# EAGLE design Robo-Badge_v10 (EAGLE 7.7.0)
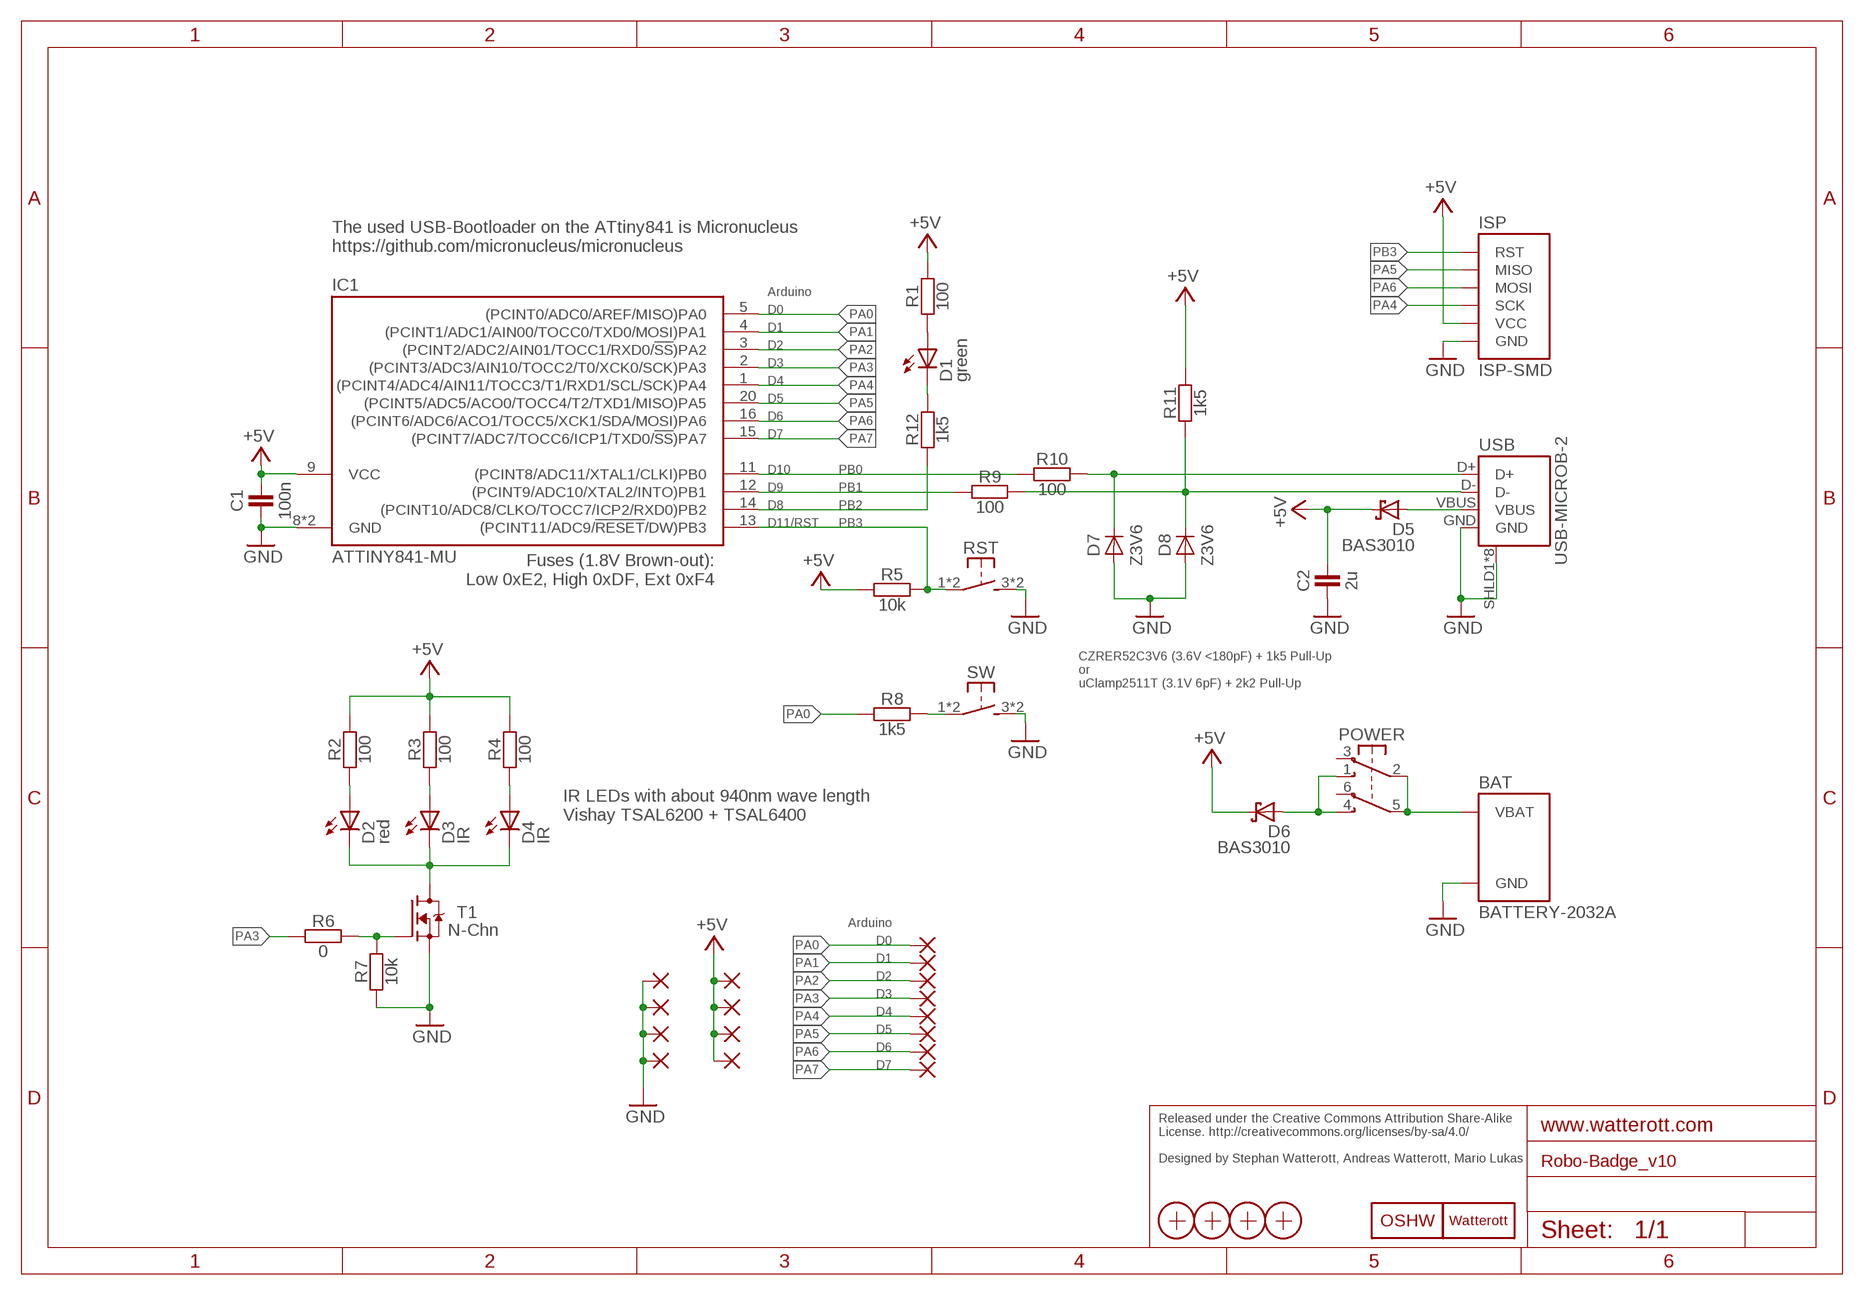
[diagram p0: schematic, sheet 1]

## Parts
BAT  BATTERY-2032A  [BAT-4UC-05581]
C1  100n  CAPACITOR-0402  [C0402]
C2  2u  CAPACITOR-0402  [C0402]
D1  green  LED-5MM  [LED_5MM]
D2  red  LED-5MM  [LED_5MM]
D3  IR  LED-5MM  [LED_5MM]
D4  IR  LED-5MM  [LED_5MM]
D5  BAS3010  D_SCHOTTKY-SOD323  [SOD323]
D6  BAS3010  D_SCHOTTKY-SOD323  [SOD323]
D7  Z3V6  DIODE-SOD723  [SOD723]
D8  Z3V6  DIODE-SOD723  [SOD723]
GND_1  PAD-WEARABLE  [PAD-WEARABLE]
GND_2  PAD-WEARABLE  [PAD-WEARABLE]
GND_3  PAD-WEARABLE  [PAD-WEARABLE]
GND_4  PAD-WEARABLE  [PAD-WEARABLE]
IC1  ATTINY841-MU  [QFN20-PAD]
ISP  ISP-SMD  [ISP-2X3_SMD]
LOGO1  LOGO-S_PLACE_M  [SPARK_TPLACE_M]
LOGO2  OSHW_LOGOX0150  [OSHW_6X150]
PA0  PAD-WEARABLE  [PAD-WEARABLE]
PA1  PAD-WEARABLE  [PAD-WEARABLE]
PA2  PAD-WEARABLE  [PAD-WEARABLE]
PA3  PAD-WEARABLE  [PAD-WEARABLE]
PA4  PAD-WEARABLE  [PAD-WEARABLE]
PA5  PAD-WEARABLE  [PAD-WEARABLE]
PA6  PAD-WEARABLE  [PAD-WEARABLE]
PA7  PAD-WEARABLE  [PAD-WEARABLE]
POWER  SW-2UM-CUS22B  [CUS22B]
R1  100  RESISTOR10LP  [R0207/10-LARGE_PADS]
R2  100  RESISTOR10LP  [R0207/10-LARGE_PADS]
R3  100  RESISTOR10LP  [R0207/10-LARGE_PADS]
R4  100  RESISTOR10LP  [R0207/10-LARGE_PADS]
R5  10k  RESISTOR-0402  [C0402]
R6  0  RESISTOR-0402  [C0402]
R7  10k  RESISTOR-0402  [C0402]
R8  1k5  RESISTOR-0402  [C0402]
R9  100  RESISTOR-0402  [C0402]
R10  100  RESISTOR-0402  [C0402]
R11  1k5  RESISTOR-0402  [C0402]
R12  1k5  RESISTOR-0402  [C0402]
RST  SW-TACTILE-6X6  [SW6X6]
SW  SW-TACTILE-6X6  [SW6X6]
T1  N-Chn  MOSFET-N-SOT23  [SOT23]
USB  USB-MICROB-2  [USB-MICROB-10118194]
VCC_1  PAD-WEARABLE  [PAD-WEARABLE]
VCC_2  PAD-WEARABLE  [PAD-WEARABLE]
VCC_3  PAD-WEARABLE  [PAD-WEARABLE]
VCC_4  PAD-WEARABLE  [PAD-WEARABLE]
X1  PASSER-07  [PASSER_07MM]
X2  PASSER-07  [PASSER_07MM]
X3  PASSER-07  [PASSER_07MM]
X4  PASSER-07  [PASSER_07MM]

## Nets
+5V: C1.2 C2.2 D5.C D6.C IC1.9(VCC) ISP.VCC R1.2 R2.1 R3.1 R4.1 R5.2 R11.1 VCC_1.1(P) VCC_1.2(P) VCC_1.3(P) VCC_2.1(P) VCC_2.2(P) VCC_2.3(P) VCC_3.1(P) VCC_3.2(P) VCC_3.3(P) VCC_4.1(P) VCC_4.2(P) VCC_4.3(P)
D_N: D8.C R9.2 R11.2 USB.D-
D_P: D7.C R10.2 USB.D+
DC: D2.C D3.C D4.C T1.3(D)
GND: BAT.GND C1.1 C2.1 D7.A D8.A GND_1.1(P) GND_1.2(P) GND_1.3(P) GND_2.1(P) GND_2.2(P) GND_2.3(P) GND_3.1(P) GND_3.2(P) GND_3.3(P) GND_4.1(P) GND_4.2(P) GND_4.3(P) IC1.8(GND) IC1.TP(GND) ISP.GND R7.2 RST.3(S1) RST.4(S1) SW.3(S1) SW.4(S1) T1.2(S) USB.GND USB.SHLD1(SHIELD) USB.SHLD2(SHIELD) USB.SHLD3(SHIELD) USB.SHLD4(SHIELD) USB.SHLD5(SHIELD) USB.SHLD6(SHIELD) USB.SHLD7(SHIELD) USB.SHLD8(SHIELD)
LED: R6.1 R7.1 T1.1(G)
LED+: D1.A R1.1
LED-: D1.C R12.1
PA0: IC1.5((PCINT0/ADC0/AREF/MISO)PA0) PA0.1(P) PA0.2(P) PA0.3(P) R8.1
PA1: IC1.4((PCINT1/ADC1/AIN00/TOCC0/TXD0/MOSI)PA1) PA1.1(P) PA1.2(P) PA1.3(P)
PA2: IC1.3((PCINT2/ADC2/AIN01/TOCC1/RXD0/!SS!)PA2) PA2.1(P) PA2.2(P) PA2.3(P)
PA3: IC1.2((PCINT3/ADC3/AIN10/TOCC2/T0/XCK0/SCK)PA3) PA3.1(P) PA3.2(P) PA3.3(P) R6.2
PA4: IC1.1((PCINT4/ADC4/AIN11/TOCC3/T1/RXD1/SCL/SCK)PA4) ISP.SCK PA4.1(P) PA4.2(P) PA4.3(P)
PA5: IC1.20((PCINT5/ADC5/ACO0/TOCC4/T2/TXD1/MISO)PA5) ISP.MISO PA5.1(P) PA5.2(P) PA5.3(P)
PA6: IC1.16((PCINT6/ADC6/ACO1/TOCC5/XCK1/SDA/MOSI)PA6) ISP.MOSI PA6.1(P) PA6.2(P) PA6.3(P)
PA7: IC1.15((PCINT7/ADC7/TOCC6/ICP1/TXD0/!SS!)PA7) PA7.1(P) PA7.2(P) PA7.3(P)
PB0: IC1.11((PCINT8/ADC11/XTAL1/CLKI)PB0) R10.1
PB1: IC1.12((PCINT9/ADC10/XTAL2/INTO)PB1) R9.1
PB2: IC1.14((PCINT10/ADC8/CLKO/TOCC7/ICP2/RXD0)PB2) R12.2
PB3: IC1.13((PCINT11/ADC9/!RESET!/DW)PB3) ISP.RST R5.1 RST.1 RST.2(P1)
RD2: D2.A R2.2
RD3: D3.A R3.2
RD4: D4.A R4.2
SW: R8.2 SW.1 SW.2(P1)
VBAT: BAT.VBAT POWER.2(P1) POWER.5(P2)
VBUS: D5.A USB.VBUS
VCC: D6.A POWER.1(S1) POWER.4(S2)
Unconnected: POWER.3(O1) POWER.6(O2)

## Notes on the sheet
- The used USB-Bootloader on the ATtiny841 is Micronucleus 
  https://github.com/micronucleus/micronucleus
- Arduino
- D0
- D1
- D2
- D3
- D4
- D5
- D6
- D7
- D10
- D9
- D8
- D11/RST
- Fuses (1.8V Brown-out):
  Low 0xE2, High 0xDF, Ext 0xF4
- CZRER52C3V6 (3.6V <180pF) + 1k5 Pull-Up 
  or
  uClamp2511T (3.1V 6pF) + 2k2 Pull-Up
- IR LEDs with about 940nm wave length
  Vishay TSAL6200 + TSAL6400
- Arduino
- D0
- D1
- D2
- D3
- D4
- D5
- D6
- D7
- Released under the Creative Commons Attribution Share-Alike 
  License. http://creativecommons.org/licenses/by-sa/4.0/
  
  Designed by Stephan Watterott, Andreas Watterott, Mario Lukas

## Library data of the parts
BAT = we-power:BATTERY: Battery Holder
C1 C2 = we-rcl:CAPACITOR: Capacitors ...2.2uF @ 6.3V -> 0402 ...4.7uF @ 6.3V -> 0603 ...10uF @ 16V -> 0805 ...22uF @ 25V -> 1206
D1-D4 = we-opto:LED: LEDs red, green, blue -> 0603
D5 D6 = we-rcl:D_SCHOTTKY: Schottky Diodes 1A, 30V - SOD323 (BAS3010) 2A, 30V - SMA/DO214AC
D7 D8 = we-rcl:DIODE: Diodes
GND_1-GND_4 PA0 PA1-PA7 VCC_1-VCC_4 = we-rcl:PAD: Pads and Test-Points
IC1 = we-chip:ATTINY841: Atmel ATtiny441/841 AVR Microcontroller
ISP = we-board:ISP: AVR ISP connector
LOGO1 = we-symbol:LOGO: Watterott electronic Logo
LOGO2 = we-symbol:OSHW_LOGO: Open-Source-Hardware Logo
POWER = we-switch:SW-2UM: Switch; DIGIKEY: 563-1105-6-ND
R1-R12 = we-rcl:RESISTOR: Resistors all kinds in 0402 and 0603
RST SW = we-switch:SW-TACTILE: Tactile Switches
T1 = we-transistor:MOSFET-N: N-Channel MOSFET TSM3404, IRLML2502 (Vgs>=+/-20V, Vds>=20V, Id>=3A + Rds<=0.05Ohm @ Vgs=4.5V) BSS138 (Vgs>=+/-20V, Vds>=40V, Id>=0.2A + Rds<=3Ohm @ Vgs=4.5V)
USB = we-con:USB: USB Connectors; DIGIKEY: 609-4618-6-ND
X1-X4 = we-symbol:PASSER: Fiducial Markers

## Board
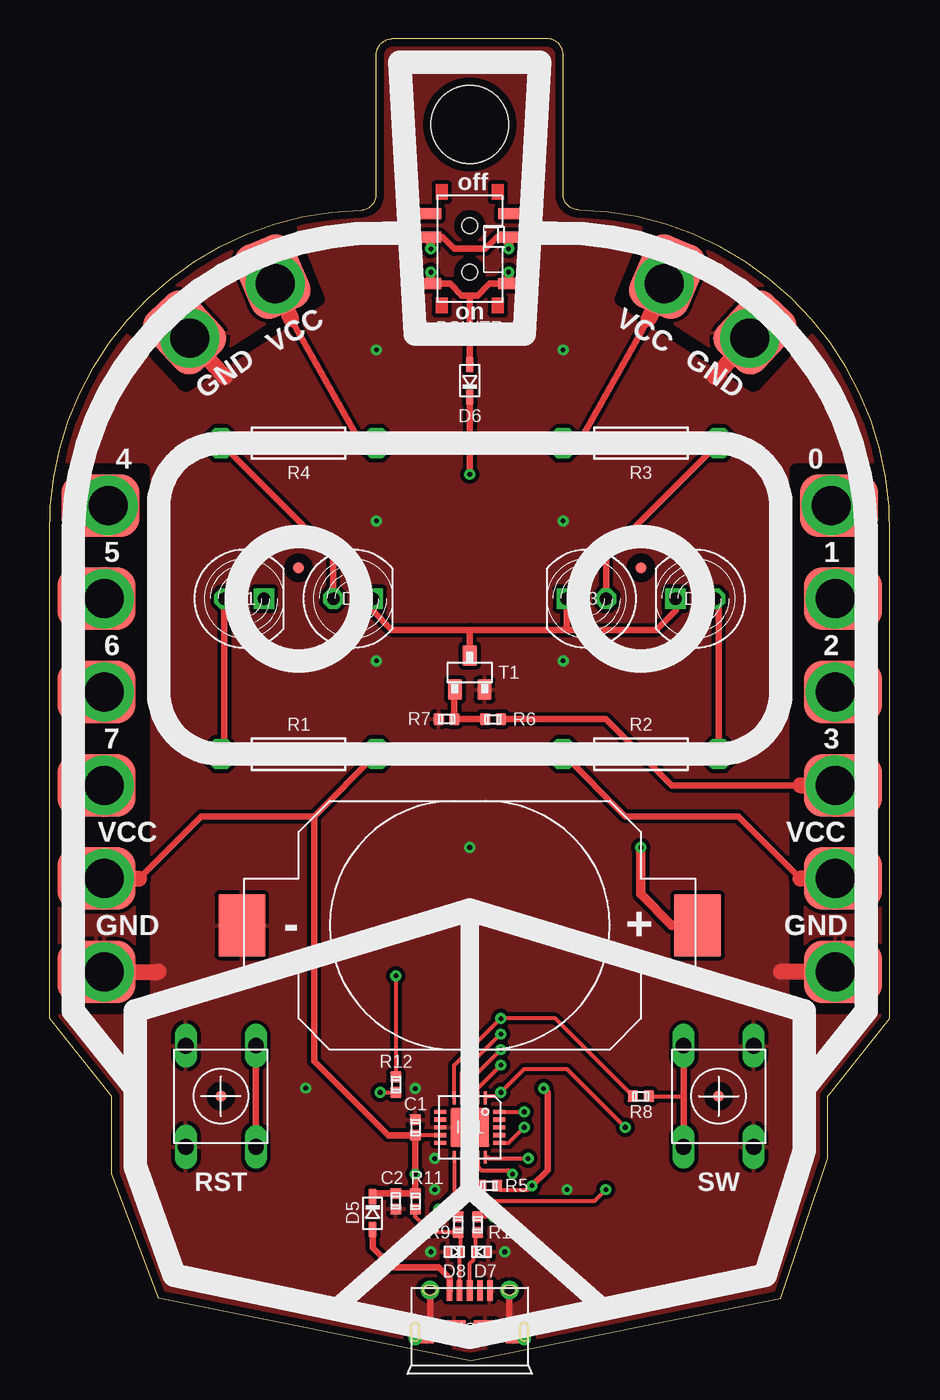
[diagram p1: board, top side]
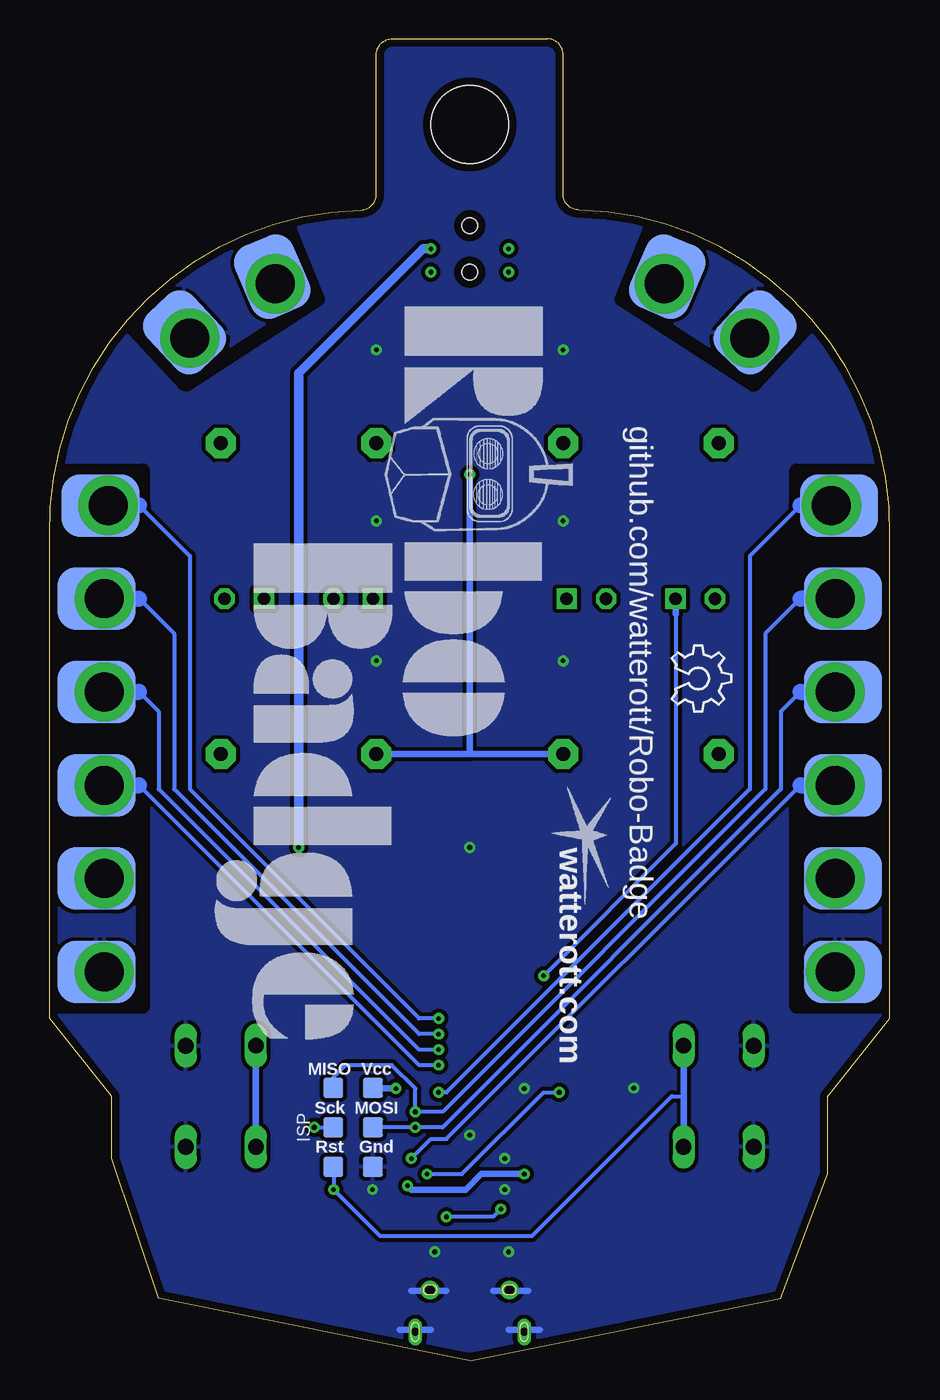
[diagram p2: board, bottom side, seen from below]

Size 54 x 85 mm. Coordinates in mm from the lower left corner, seen from the top.
Outline: 27,0 7,4 4,12 4,17 0,22 0,53 arc-90 20,74 arc90 21,75 21,84 arc-90 22,85 32,85 arc-90 33,84 33,75 arc90 34,74 arc-90 54,53 54,22 50,17 50,13 47,4 27,0
Copper layers (1*16): Top 0.035mm / dielectric 1.5mm / Bottom 0.035mm
Design rules "we-dru-2-layer *": minimum track width 0.15mm, minimum drill 0.3mm, track to track 0.15mm, track to pad 0.15mm, pad to pad 0.15mm, via to via 0.15mm, smd to smd 0.1mm, copper to edge 0.5mm, drill to drill 0.2mm, minimum pad ring 0.18mm, minimum via ring 0.2mm, stop-mask expansion 0.1mm, vias tented up to drill 0.5mm, thermal gap 0.25mm
Holes 5 mm at 27,79.5
tRestrict: 12 lines
bRestrict: 12 lines

### Footprints (pad centres in the part's own frame; a part is rotated, then mirrored left to right if it is on the bottom)
BAT-4UC-05581 = smd 4 x 3: GND 0,-14.65; VBAT 0,14.65
C0402 = smd 0.75 x 0.7: 1 0,0.5; 2 0,-0.5
LED_5MM = drill 0.8 pad 1.3 octagon: A 0,-1.27 | drill 0.8 pad 1.3 square: C 0,1.27
SOD323 = smd 0.5 x 1: A 0,-1.05; C 0,1.05
SOD723 = smd 0.8 x 0.5: A 0,-0.425; C 0,0.425
PAD-WEARABLE = drill 2.5 pad 3.81: 1 0,0 | smd 5 x 4 bottom: 2 0.5,0 | smd 5 x 4: 3 0.5,0
QFN20-PAD = smd 0.8 x 0.26: 1 -1.9,1; 2 -1.9,0.5; 3 -1.9,0; 4 -1.9,-0.5; 5 -1.9,-1; 11 1.9,-1; 12 1.9,-0.5; 13 1.9,0; 14 1.9,0.5; 15 1.9,1 | smd 0.26 x 0.8: 6 -1,-1.9; 7 -0.5,-1.9; 8 0,-1.9; 9 0.5,-1.9; 10 1,-1.9; 16 1,1.9; 17 0.5,1.9; 18 0,1.9; 19 -0.5,1.9; 20 -1,1.9 | smd 2.5 x 2.5: TP 0,0
ISP-2X3_SMD = smd 1.27 x 1.27: GND 1.27,-2.54; MISO -1.27,2.54; MOSI 1.27,0; RST -1.27,-2.54; SCK -1.27,0; VCC 1.27,2.54
CUS22B = smd 0.7 x 1.5: 1 -2.25,2.55; 2 0.75,2.55; 3 2.25,2.55; 4 -2.25,-2.55; 5 0.75,-2.55; 6 2.25,-2.55 | hole 1: -1.5,0; 1.5,0
R0207/10-LARGE_PADS = drill 0.9 pad 1.93 octagon: 1 -5,0; 2 5,0
SW6X6 = drill 1 long: 1 -3.25,2.25; 2 3.25,2.25 | drill 1.016 long: 3 -3.25,-2.25; 4 3.25,-2.25
SOT23 = smd 1.3 x 0.9: 1 -1.1,0.95; 2 -1.1,-0.95; 3 1.1,0
USB-MICROB-10118194 = smd 1.3 x 0.4: D+ -2.5,0; D- -2.5,-0.65; GND -2.5,1.3; ID -2.5,0.65; VBUS -2.5,-1.3 | drill 0.6 pad 1.2: SHLD1 -2.55,2.55; SHLD2 -2.55,-2.55 | drill 0.5 pad 0.8 long: SHLD3 0.15,3.5; SHLD4 0.15,-3.5 | smd 1.5 x 1.1: SHLD5 0.15,2.85; SHLD6 0.15,-2.85 | smd 1.5 x 1.5: SHLD7 0.15,1; SHLD8 0.15,-1
PASSER_07MM = smd 0.7 x 0.7: X 0,0

### Placement (x,y rotation side)
BAT  27,28 270 top
C1  23.5,15 0 top
C2  22.25,10.25 180 top
D1  12.5,49 270 top
D2  41.5,49 90 top
D3  34.5,49 90 top
D4  19.5,49 270 top
D5  20.75,9.5 0 top
D6  27,63 180 top
D7  27.75,7 90 top
D8  26,7 270 top
GND_1  45,65.75 47 top
GND_2  9,65.75 133 top
GND_3  50.5,25 0 top
GND_4  3.5,25 180 top
IC1  27,15 270 top
ISP  34.5,15 0 bottom
LOGO1  19.5,33.75 270 bottom
LOGO2  14,46 270 bottom
PA0  50.25,55 0 top
PA1  50.5,49 0 top
PA2  50.5,43 0 top
PA3  50.5,37 0 top
PA4  3.75,55 180 top
PA5  3.5,49 180 top
PA6  3.5,43 180 top
PA7  3.5,37 180 top
POWER  27,71.5 90 top
R1  16,39 0 top
R2  38,39 0 top
R3  38,59 0 top
R4  16,59 180 top
R5  28.25,11.25 90 top
R6  28.5,41.25 90 top
R7  25.5,41.25 270 top
R8  38,17 90 top
R9  26.25,8.75 0 top
R10  27.5,8.75 0 top
R11  23.5,10.25 0 top
R12  22.25,17.75 0 top
RST  11,17 270 top
SW  43,17 90 top
T1  27,44.25 90 top
USB  27,2 270 top
VCC_1  39.5,69.25 67 top
VCC_2  14.5,69.25 113 top
VCC_3  50.5,31 0 top
VCC_4  3.5,31 180 top
X1  11,17 0 top
X2  16,51 0 top
X3  38,51 0 top
X4  43,17 0 top

### Tracks (layer width: path | path; a pad name or v marks a point on that pad's centre or on a via)
+5V  (via drill 0.3)
  Top 0.254: IC1.9 C1.2 | 20.75,10.75 D5.C | R5.2 29,11 30.75,11 v31,11.25
  Top 0.406: D6.C 27,59 | 15.5,67 20,59 R4.1 27,59 | 38.5,67 34,59 R3.1 27,59 | 27,59 v27,57 | VCC_3.3 VCC_3.1 | 5.75,31 9.75,35 17,35 | 17,35 R1.2 | 48.25,31 44.25,35 37,35 R2.1 | 20.75,10.75 C2.2 R11.1 v23.5,12 C1.2 21.75,14.5 17,19.25 17,35 | v31.75,17.5 32,17.25 32,12.25 v31,11.25 | VCC_4.3 VCC_4.1 | VCC_1.2 VCC_1.1 | VCC_2.2 VCC_2.1
  Top 1.016: VCC_2.1 15.5,67 | VCC_1.1 38.5,67 | VCC_4.1 5.75,31 | VCC_3.1 48.25,31
  Bottom 0.254: 33.19,17.5 ISP.VCC
  Bottom 0.406: R1.2 27,39 | R2.1 27,39 | 27,39 v27,57 | v31.75,17.5 33.19,17.5 | v31,11.25 30.75,11 27.25,11 26.25,12 v23.5,12 | 50,31 VCC_3.1 VCC_3.3 | VCC_4.3 VCC_4.1 | VCC_1.2 VCC_1.1 | VCC_2.2 VCC_2.1
D_N
  Top 0.254: USB.D- 26.35,6.95 D8.C 26.4,7.03 26.4,8.1 R9.2 24.5,8.25 23.5,9.25 R11.2
D_P
  Top 0.254: USB.D+ 27,6.25 27.25,6.5 27.25,6.92 D7.C 27.35,7.03 27.35,8.1 R10.2
DC
  Top 0.406: D4.C 20.77,48.23 22,47 27,47 | 27,47 33.25,47 | 33.25,47 39,47 40.23,48.23 D2.C | D3.C 33.23,47.02 33.25,47 | T1.3 27,47
  Bottom 0.406: 40.21,48.51 40.23,48.54 D2.C
GND  (via drill 0.3)
  Top 0.406: USB.SHLD2 24.45,1.85 USB.SHLD4 USB.SHLD5 | USB.SHLD1 29.55,1.85 USB.SHLD5 | USB.SHLD5 USB.SHLD3
  Top 1.016: GND_4.1 7,25 | GND_3.1 47,25 | GND_2.1 11.25,63.25 | GND_1.1 42.75,63.25
  Bottom 0.406: 22.5,2 24.5,2 | 29.5,2 31.5,2 | 23.25,4.5 25.5,4.5 | 28.5,4.5 30.75,4.5
  other vias: 16.46,17.52 21,65 33,65 33,54 21,45 33,45 27,14.5 24.5,7 29.25,7 24.75,13 33.25,11 27,33 24.75,11 23.5,17.5 21,54
  pour Top (isolate 0.254): 0,85 54,85 54,0 0,0
  pour Bottom (isolate 0.254): 0,85 54,85 54,0 0,0
LED
  Top 0.406: R6.1 R7.1 26,43.15 T1.1
LED+
  Top 0.406: D1.A 11.23,39.23 R1.1
LED-  (via drill 0.3)
  Top 0.254: v22.25,24.75 R12.1
  Bottom 0.254: 13.75,48 13.75,33.25 v22.25,24.75
  Bottom 0.406: 13.75,48 13.75,48.98
  Bottom 0.61: 13.75,48.98 D1.C
PA0  (via drill 0.3)
  Top 0.254: IC1.5 26,19 v29,22 32.5,22 R8.1
  Top 0.406: PA0.2 PA0.1
  Bottom 0.254: 48.25,55 45,51.75 45,36.75 30.25,22 v29,22
  Bottom 0.406: PA0.2 PA0.1
  Bottom 1.016: PA0.1 48.25,55
PA1  (via drill 0.3)
  Top 0.254: IC1.4 26.5,18.5 v29,21
  Top 0.406: PA1.2 PA1.1
  Bottom 0.254: 48.25,49 46,46.75 46,36.75 30.25,21 v29,21
  Bottom 0.406: PA1.2 PA1.1
  Bottom 1.016: PA1.1 48.25,49
PA2  (via drill 0.3)
  Top 0.254: IC1.3 27,18 v29,20
  Top 0.406: PA2.2 PA2.1
  Bottom 0.254: 48.25,43 47,41.75 47,36.75 30.25,20 v29,20
  Bottom 0.406: PA2.2 PA2.1
  Bottom 1.016: PA2.1 48.25,43
PA3  (via drill 0.3)
  Top 0.254: IC1.2 27.5,17.5 v29,19
  Top 0.406: PA3.1 PA3.2 | PA3.2 | R6.2 35.75,41.25 40,37 48.25,37 PA3.2
  Top 1.016: 48.25,37 50,37
  Bottom 0.254: 48.25,37 30.25,19 v29,19
  Bottom 0.406: 48,37 48.25,37 PA3.2
  Bottom 1.016: PA3.1 48.25,37
PA4  (via drill 0.3)
  Top 0.254: IC1.1 28.1,17 28.75,17 v29,17.25 30.5,18.75 33.25,18.75 v37,15
  Top 0.406: PA4.2 PA4.1
  Bottom 0.254: 5.75,55 9,51.75 9,36.75 28.5,17.25 v29,17.25 | v37,15 ISP.SCK
  Bottom 0.406: PA4.2 PA4.1
  Bottom 1.016: PA4.1 5.75,55
PA5  (via drill 0.3)
  Top 0.254: IC1.20 v30.5,16
  Top 0.406: PA5.2 PA5.1
  Bottom 0.254: 5.75,49 8,46.75 8,36.75 28.75,16 v30.5,16 30.5,17.5 32,19 35,19 35.77,18.23 ISP.MISO
  Bottom 0.406: PA5.2 PA5.1
  Bottom 1.016: PA5.1 5.75,49
PA6  (via drill 0.3)
  Top 0.254: IC1.16 29.5,14 v30.5,15
  Top 0.406: PA6.2 PA6.1
  Bottom 0.254: 5.75,43 7,41.75 7,36.75 28.75,15 v30.5,15 ISP.MOSI
  Bottom 0.406: PA6.2 PA6.1
  Bottom 1.016: 5.75,43 PA6.1
PA7  (via drill 0.3)
  Top 0.254: IC1.15 28.15,13.1 28.25,13 v30.75,13
  Top 0.406: PA7.2 PA7.1
  Bottom 0.254: v30.75,13 29.5,14.25 28.5,14.25 5.75,37
  Bottom 0.406: PA7.2 PA7.1
  Bottom 1.016: 5.75,37 PA7.1
PB0  (via drill 0.3)
  Top 0.254: IC1.11 26,10.75 v25,9.75 | v28.5,9.25 R10.1
  Bottom 0.254: v25,9.75 25.5,9.25 v28.5,9.25
PB1
  Top 0.254: IC1.12 26.5,10.25 26,9.75 26,9.5 R9.1
PB2  (via drill 0.3)
  Top 0.254: IC1.14 27.5,12.5 27.75,12.25 29.5,12.25 v29.75,12 | v21.25,17.25 R12.2
  Bottom 0.254: v29.75,12 27.5,12 R12.2 v21.25,17.25
PB3  (via drill 0.3)
  Top 0.254: IC1.13 27,12 R5.1 27.75,10.75 28.25,10.25 35,10.25 v35.75,11
  Top 0.406: RST.1 RST.2
  Bottom 0.254: ISP.RST 35.77,12.48 35.75,12.5 v35.75,11 32.75,8 23,8 14,17 13.25,17
  Bottom 0.406: RST.1 13.25,17 RST.2
RD2
  Top 0.406: R2.2 43,48.77 D2.A
RD3
  Top 0.406: D3.A 35.77,51.77 R3.2
RD4
  Top 0.406: D4.A 18.23,51.77 R4.2
SW
  Top 0.254: R8.2 40.75,17
  Top 0.406: SW.1 40.75,17 SW.2
  Bottom 0.406: SW.2 SW.1
VBAT  (via drill 0.3)
  Top 0.406: 24.5,72.2 POWER.2 25.25,72.25 26,71.5 28,71.5 28.75,72.25 POWER.5 29.5,72.2
  Top 0.61: v24.5,71.5 24.5,72.2 | v29.5,71.5 29.5,72.2 | BAT.VBAT 40,28 38,30 v38,33
  Bottom 0.61: v38,33 38,63.5 30,71.5 v29.5,71.5
VBUS
  Top 0.406: USB.VBUS 25.7,5.3 25,6 22,6 20.75,7.25 D5.A
VCC  (via drill 0.3)
  Top 0.406: 27,68.5 27.5,68.5 28.25,69.25 POWER.4 29.5,69.3 | 27,68.5 26.5,68.5 25.75,69.25 POWER.1 24.5,69.3 | D6.A 27,68.5
  Top 0.61: v24.5,70 24.5,69.3 | v29.5,70 29.5,69.3

### Text on the board
tPlace: off | on | VCC | VCC | GND | GND | 4 | 0 | 5 | 1 | 6 | 2 | 7 | 3 | VCC | VCC | GND | GND
bPlace: github.com/watterott/Robo-Badge | watterott.com | Vcc | MISO | MOSI | Sck | Gnd | Rst
Document: PA4 | PA0 | PA5 | PA1 | PA6 | PA2 | PA7 | PA3
Reference: Silkscreen: 21 tPlace + 22bPlace